# EAGLE design Side 1 esp32 old (EAGLE 8.5.1)
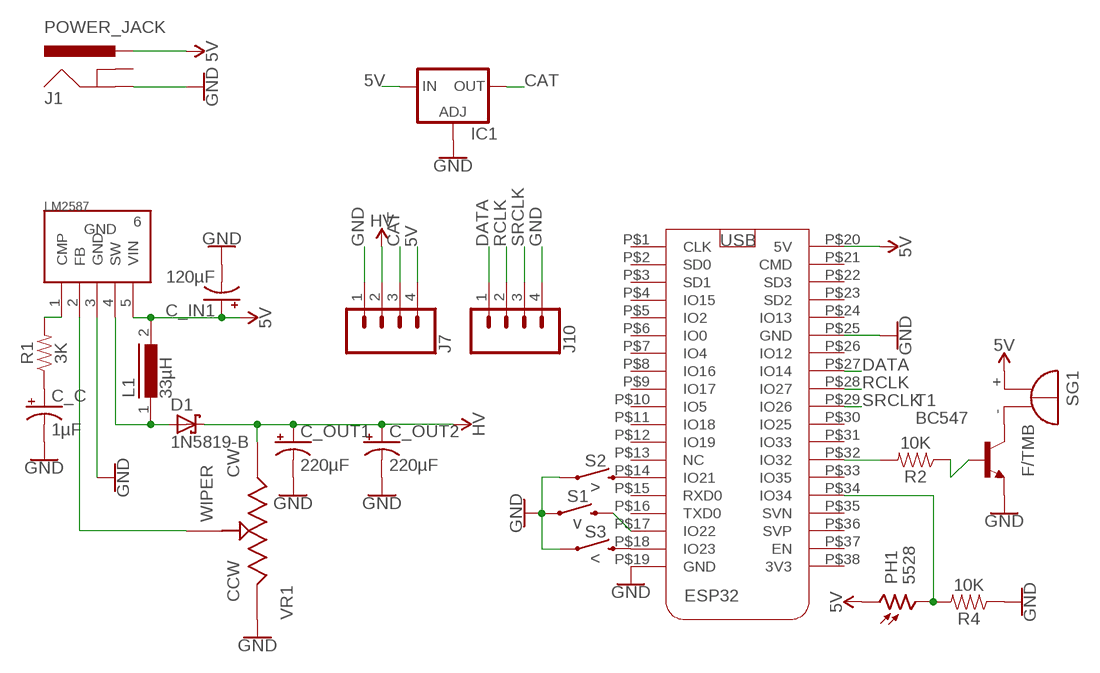
[diagram p0: schematic, sheet 1]

## Parts
C_C  1µF  CAP_POL_1µF  [CAP_POL_2MM]
C_IN1  120µF  CAP_POL_120µF  [CAP_POL_3MM]
C_OUT1  220µF  1000UF-RADIAL-5MM-25V-20%  [CPOL-RADIAL-5MM-10MM]
C_OUT2  220µF  1000UF-RADIAL-5MM-25V-20%  [CPOL-RADIAL-5MM-10MM]
D1  1N5819-B  [DO41-7.6]
ESP32  ESP32_DEVKIT  [ESP32_DEVKIT]
IC1  LM317TS  [317TS]
J1  POWER_JACK  [POWER_JACK_PTH]
J7  CONN_04  [1X04]
J10  CONN_04  [1X04]
L1  33µH  MICC12  [MICC12]
LM2587  LM2587S  [TO263-5]
PH1  5528  [5528]
R1  3K  RESISTORAXIAL-0.3  [AXIAL-0.3]
R2  10K  RESISTORAXIAL-0.3  [AXIAL-0.3]
R4  10K  RESISTORAXIAL-0.3  [AXIAL-0.3]
S1  v  MOMENTARY-SWITCH-SPST-PTH-6.0MM  [TACTILE_SWITCH_PTH_6.0MM]
S2  >  MOMENTARY-SWITCH-SPST-PTH-6.0MM  [TACTILE_SWITCH_PTH_6.0MM]
S3  <  MOMENTARY-SWITCH-SPST-PTH-6.0MM  [TACTILE_SWITCH_PTH_6.0MM]
SG1  F/TMB  [F/TMB]
T1  BC547  [TO92]
VR1  3296W-1-103LF  [W]

## Nets
5V: C_IN1.POS(+) ESP32.P$20(5V) IC1.3(IN) J1.PWR J7.4 L1.2 LM2587.5(VIN) PH1.1 SG1.+
CAT: IC1.2(OUT) J7.3
DATA: ESP32.P$27(IO14) J10.1
GND: C_C.NEG(-) C_IN1.NEG(-) C_OUT1.- C_OUT2.- ESP32.P$19(GND) ESP32.P$25(GND) IC1.1(ADJ) J1.GND J7.1 J10.4 LM2587.3(GND) R4.P$1 S1.1 S2.1 S3.1 T1.1(E) VR1.1
N$1: D1.A L1.1 LM2587.4(SW)
N$2: LM2587.1(CMP) R1.P$2
N$3: LM2587.2(FB) VR1.2
N$4: C_C.POS(+) R1.P$1
N$5: ESP32.P$34(IO34) PH1.2 R4.P$2
N$6: ESP32.P$17(IO22) S1.3
N$7: ESP32.P$18(IO23) S3.3
N$8: ESP32.P$14(IO21) S2.3
N$9: SG1.- T1.3(C)
N$10: R2.P$1 T1.2(B)
N$11: ESP32.P$32(IO32) R2.P$2
RCLK: ESP32.P$28(IO27) J10.2
SRCLK: ESP32.P$29(IO26) J10.3
VCC: C_OUT1.+ C_OUT2.+ D1.C J7.2 VR1.3 ; supply symbol labelled HV
Unconnected: ESP32.P$1(CLK) ESP32.P$2(SD0) ESP32.P$3(SD1) ESP32.P$4(IO15) ESP32.P$5(IO2) ESP32.P$6(IO0) ESP32.P$7(IO4) ESP32.P$8(IO16) ESP32.P$9(IO17) ESP32.P$10(IO5) ESP32.P$11(IO18) ESP32.P$12(IO19) ESP32.P$13(NC) ESP32.P$15(RXD0) ESP32.P$16(TXD0) ESP32.P$21(CMD) ESP32.P$22(SD3) ESP32.P$23(SD2) ESP32.P$24(IO13) ESP32.P$26(IO12) ESP32.P$30(IO25) ESP32.P$31(IO33) ESP32.P$33(IO35) ESP32.P$35(SVN) ESP32.P$36(SVP) ESP32.P$37(EN) ESP32.P$38(3V3) J1.GNDBREAK LM2587.6(GND)

## Library data of the parts
C_C = Clock components:CAP_POL_1µF
C_IN1 = Clock components:CAP_POL_120µF
C_OUT1 C_OUT2 = SparkFun-Capacitors:1000UF: 1,000µF/1mF ceramic capacitors A capacitor is a passive two-terminal electrical component used to store electrical energy temporarily in an electric field. CAP-08070; PROD_ID: CAP-09538; VALUE: 1mF
D1 = diode:1N581*: 1.0A SCHOTTKY BARRIER RECTIFIER Source: http://www.diodes.com/datasheets/ds23001.pdf
ESP32 = Clock components:ESP32_DEVKIT
IC1 = v-reg:LM317TS: VOLTAGE REGULATOR
J1 = SparkFun-Connectors:POWER_JACK: Power Jack Connector This is the standard 5.5mm barrel jack for power. The PTH is the most common, proven, reliable, footprint. The Slot footprint only works if the mill layer is transmitted to the PCB fab house so be warned. Here are the connectors we sell at SparkFun: DC Barrel Power Jack/Connector <https://www.sparkfun.com/products/119> (PRT-00119) DC Barrel Power Jack/Connector (SMD) <https://www.sparkfun.com/products/12748> (PRT-12748) DC Barrel Jack Adapter - Breadboard Compatible <https://www.sparkfun.com/products/10811> (PRT-10811) It is used on this SparkFun product (and many, many others): SparkFun RedBoard - Programmed with Arduino <https://www.sparkfun.com/products/12757> (DEV-12757) Also, if you need a mating power supply or connector, please check these out: Wall Adapter Power Supply - 9VDC 650mA <https://www.sparkfun.com/products/298> (TOL-00298) DC Barrel Jack Adapter - Male <https://www.sparkfun.com/products/10287> (PRT-10287); PROD_ID: CONN-08197
J7 J10 = SparkFun-Connectors:CONN_04: Multi connection point. Often used as Generic Header-pin footprint for 0.1 inch spaced/style header connections On any of the 0.1 inch spaced packages, you can populate with these: Break Away Headers - Straight <https://www.sparkfun.com/products/116> (PRT-00116) Break Away Male Headers - Right Angle <https://www.sparkfun.com/products/553> (PRT-00553) Female Headers <https://www.sparkfun.com/products/115> (PRT-00115) Break Away Headers - Machine Pin <https://www.sparkfun.com/products/117> (PRT-00117) Break Away Female Headers - Swiss Machine Pin <https://www.sparkfun.com/products/743> (PRT-00743) For SCREWTERMINALS and SPRING TERMINALS visit here: Screw Terimnals on SparkFun.com <https://www.sparkfun.com/search/results?term=Screw+Terminals> (5mm/3.5mm/2.54mm spacing) This device is also useful as a general connection point to wire up your design to another part of your project. Our various solder wires solder well into these plated through hole pads. Hook-Up Wire - Assortment (Stranded, 22 AWG) <https://www.sparkfun.com/products/11375> (PRT-11375) Hook-Up Wire - Assortment (Solid Core, 22 AWG) <https://www.sparkfun.com/products/11367> (PRT-11367) View the entire wire category on our website here <https://www.sparkfun.com/categories/141> Special notes: Molex polarized connector foot print use with SKU : PRT-08231 with associated crimp pins and housings. 1MM SMD Version SKU: PRT-10208; PROD_ID: CONN-09696
L1 = inductors:MICC12: INDUCTOR; SPICEPREFIX: L
LM2587 = Clock components:LM2587S: LM2587 SIMPLE SWITCHER 5A Flyback Regulator
PH1 = Clock components:5528
R1 R2 R4 = SparkFun-Resistors:RESISTOR: Generic Resistor Package
S1-S3 = SparkFun-Switches:MOMENTARY-SWITCH-SPST: Momentary Switch (Pushbutton) - SPST Normally-open (NO) SPST momentary switches (buttons, pushbuttons). Variants PTH-12MM - 12mm square, through-hole Momentary Pushbutton Switch - 12mm Square <https://www.sparkfun.com/products/9190> (COM-09190) PTH-6.0MM, PTH-6.0MM-KIT - 6.0mm square, through-hole Mini Pushbutton Switch <https://www.sparkfun.com/products/97> (COM-00097) KIT package intended for soldering kit's - only one side of pads' copper is exposed. PTH-RIGHT-ANGLE-KIT - Right-angle, through-hole Right Angle Tactile Button <https://www.sparkfun.com/products/10791> - Used on SparkFun BigTime Watch Kit <https://www.sparkfun.com/products/11734> SMD-12MM - 12mm square, surface-mount Tactile Button - SMD (12mm) <https://www.sparkfun.com/products/12993> (COM-12993) Used on SparkFun PicoBoard <https://www.sparkfun.com/products/11888> SMD-4.5MM - 4.5mm Square Trackball Switch Used on SparkFun Blackberry Trackballer Breakout <https://www.sparkfun.com/products/13169> SMD-4.6MMX2.8MM - 4.60mm x 2.80mm, surface mount Used on SparkFun SAMD21 Mini Breakout <https://www.sparkfun.com/products/13664> SMD-5.2MM, SMD-5.2-REDUNDANT - 5.2mm square, surface-mount Mini Pushbutton Switch - SMD <https://www.sparkfun.com/products/8720> (COM-08720) Used on Arduino Pro Mini <https://www.sparkfun.com/products/11114> REDUNDANT package connects both switch circuits together SMD-6.0X3.5MM - 6.0 x 3.5mm, surface mount Momentary Reset Switch SMD <https://www.sparkfun.com/products/8229> (COM-08229) SMD-6.2MM-TALL - 6.2mm square, surface mount Tactile Button - SMD (6mm) <https://www.sparkfun.com/products/12992> Used on SparkFun Digital Sandbox <https://www.sparkfun.com/products/12651> SMD-RIGHT-ANGLE - Right-angle, surface mount Used on SparkFun Block for Intel® Edison - Arduino <https://www.sparkfun.com/products/13036>; PROD_ID: SWCH-08441; SF_SKU: COM-00097
SG1 = buzzer:F/TMB: BUZZER Source: Buerklin; OC_FARNELL: unknown; OC_NEWARK: unknown
T1 = transistor:BC547: NPN TRANSISTOR
VR1 = Volks73-Bourns:3296?-*: Trim Potentiometer (Pot) Documentation Datasheet <http://www.bourns.com/data/global/pdfs/3296.pdf> Features Multiturn/Cermet/Industrial/Sealed 5 terminal styles Tape and reel packaging Chevron seal design Listed on the QPL for style RJ24 per MIL-R_22097 and RJR24 per High-Rel Mil-R-39035 Mounting hardware available (H-117P) RoHS compliant* version available For trimmer applications/processing guidelines, click here <http://www.bourns.com/data/global/pdfs/ap_proc.pdf>; ADJUSTMENT_TYPE: Tope Adjustment; CATEGORY: Potentiometers, Variable Resistors; DESCRIPTION: TRIMMER 10K OHM 0.5W PC PIN; DOCUMENTATION_LINK: <a href="http://www.bourns.com/data/global/pdfs/3296.pdf">Datasheet</a>; DOCUMENTATION_URL: http://www.bourns.com/data/global/pdfs/3296.pdf; FAMILY: Trimmer Potentiometers; MANUFACTURER: Bourns Inc; MOUNTING_TYPE: Through Hole; NUMBER_OF_TURNS: 25; PART_NUMBER: 3296W-1-103LF; POWER: 0.5W, 1/2W; RESISTANCE: 10k; RESISTIVE_MATERIAL: Cermet; SERIES: Trimpt 3296 - Sealed; SIZE: Rectangular - 0.375" x 0.190" Face x 0.395" H (9.53mm x 4.83mm x 10.03mm); STANDARD_PACKAGE: 50; SUPPLIER_ITEM_LINK: <a href="http://www.digikey.com/product-detail/en/3296W-1-103LF/3296W-103LF-ND/1088045">Details</a>; SUPPLIER_ITEM_NUMBER: 3296W-103LF-ND; SUPPLIER_ITEM_URL: http://www.digikey.com/product-detail/en/3296W-1-103LF/3296W-103LF-ND/1088045; SUPPLIER_LINK: <a href="http://www.digikey.com">Home Page</a>; SUPPLIER_NAME: Digi-Key; SUPPLIER_URL: http://www.digikey.com; TEMPERATURE_COEFFICIENT: 100ppm/C; TERMINATION_STYLE: PC Pin; TOLERANCE: 10%

## Board
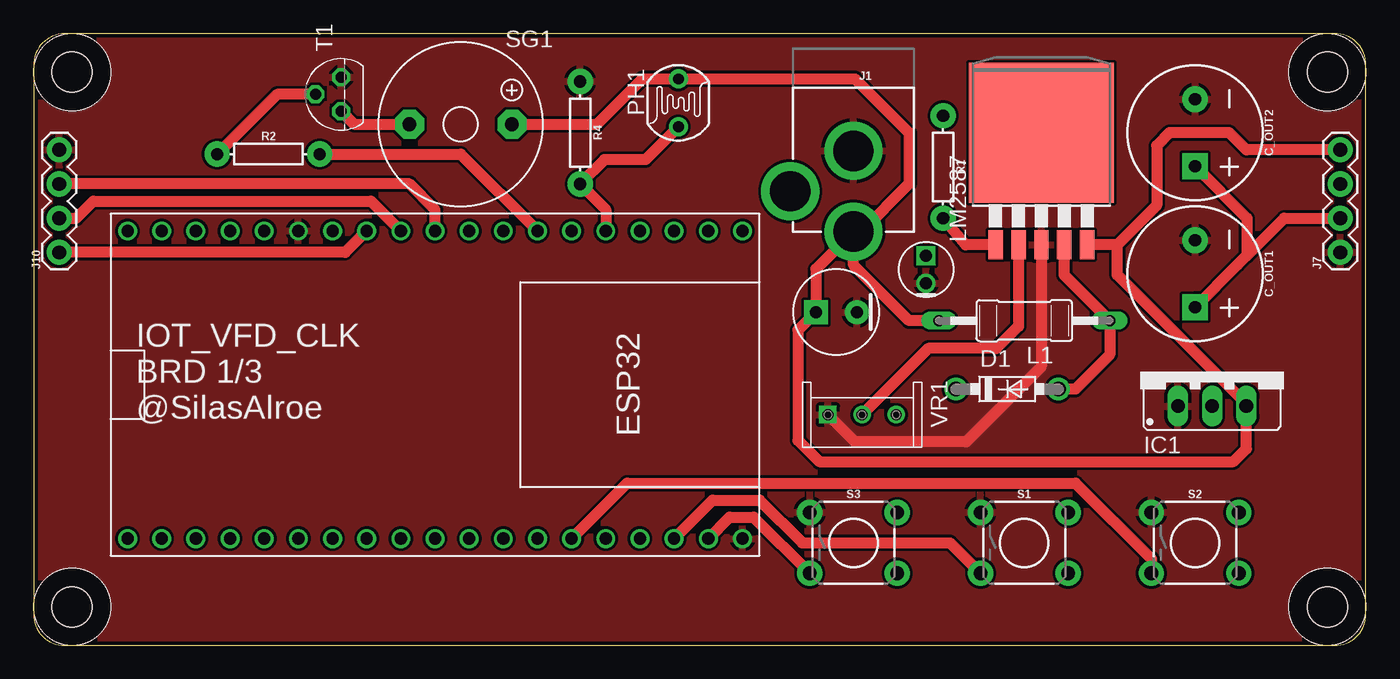
[diagram p1: board, top side]
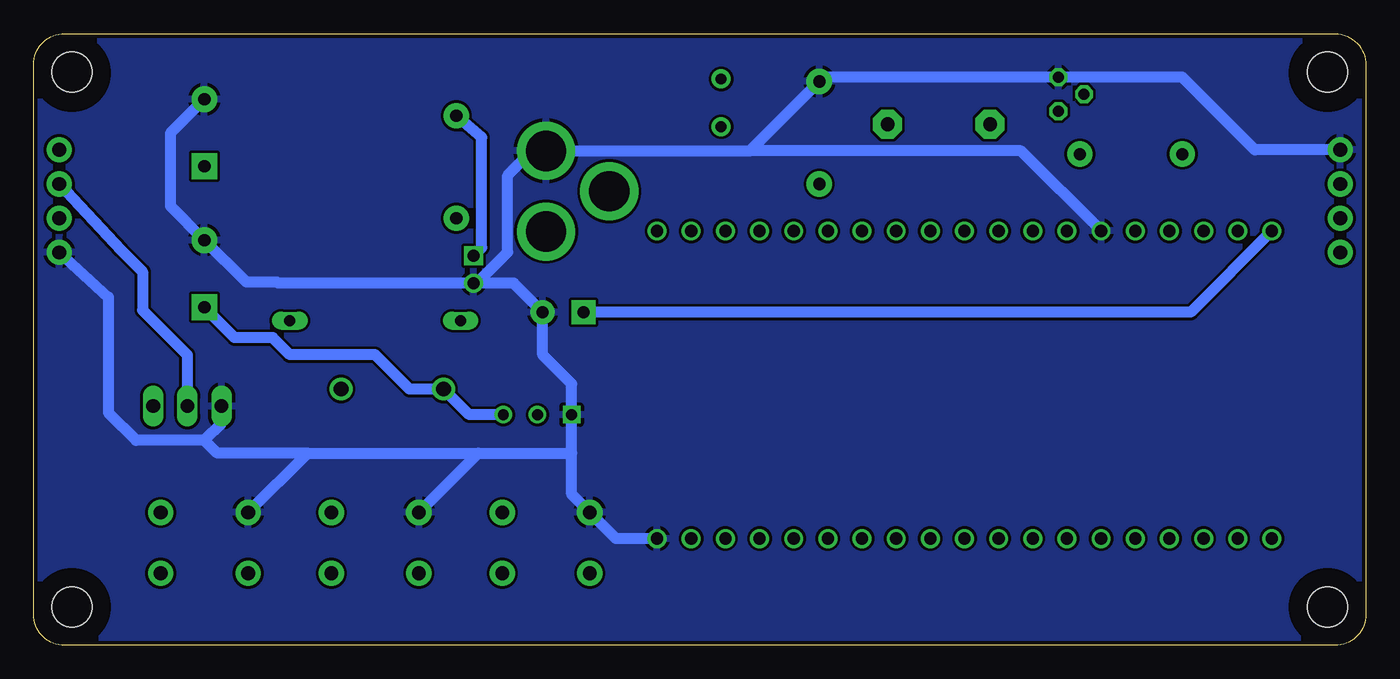
[diagram p2: board, bottom side, seen from below]

Size 99.06 x 45.47 mm. Coordinates in mm from the lower left corner, seen from the top.
Outline: 96.77,45.47 2.28,45.47 arc90 0,43.11 0,2.29 arc90 2.29,0 96.77,0 arc90 99.06,2.29 99.06,43.18 arc90 96.77,45.47
Copper layers (1*16): Top 0.035mm / dielectric 1.5mm / Bottom 0.035mm
Design rules "default *": minimum track width 12mil, minimum drill 0.35mm, track to track 8mil, track to pad 8mil, pad to pad 8mil, via to via 8mil, smd to smd 8mil, copper to edge 12mil, drill to drill 12mil, minimum pad ring 10mil, minimum via ring 8mil, stop-mask expansion 4mil, vias tented up to drill 0mil, thermal gap 10mil
Holes 3 mm at 2.86,2.86 2.86,42.61 96.2,42.61 96.2,2.86
tRestrict: area 1.2,1.2 to 4.5,4.5; area 1.2,40.9 to 4.5,44.2; area 94.6,40.9 to 97.8,44.2; area 94.6,1.2 to 97.8,4.5
bRestrict: area 1.2,1.2 to 4.5,4.5; area 1.2,40.9 to 4.5,44.2; area 94.6,40.9 to 97.8,44.2; area 94.6,1.2 to 97.8,4.5

### Footprints (pad centres in the part's own frame; a part is rotated, then mirrored left to right if it is on the bottom)
CAP_POL_2MM = drill 0.9: NEG 1.016,0 | drill 0.9 square: POS -1.016,0
CAP_POL_3MM = drill 0.9 pad 1.778: NEG 1.524,0 | drill 0.9 pad 1.778 square: POS -1.524,0
CPOL-RADIAL-5MM-10MM = drill 0.9 pad 1.93 square: + 2.5,0 | drill 0.9 pad 1.93: - -2.5,0
DO41-7.6 = drill 1.1 pad 1.7: A 3.81,0; C -3.81,0
ESP32_DEVKIT = drill 0.9: P$1 -11.43,0; P$2 -11.43,-2.54; P$3 -11.43,-5.08; P$4 -11.43,-7.62; P$5 -11.43,-10.16; P$6 -11.43,-12.7; P$7 -11.43,-15.24; P$8 -11.43,-17.78; P$9 -11.43,-20.32; P$10 -11.43,-22.86; P$11 -11.43,-25.4; P$12 -11.43,-27.94; P$13 -11.43,-30.48; P$14 -11.43,-33.02; P$15 -11.43,-35.56; P$16 -11.43,-38.1; P$17 -11.43,-40.64; P$18 -11.43,-43.18; P$19 -11.43,-45.72; P$20 11.43,0; P$21 11.43,-2.54; P$22 11.43,-5.08; P$23 11.43,-7.62; P$24 11.43,-10.16; P$25 11.43,-12.7; P$26 11.43,-15.24; P$27 11.43,-17.78; P$28 11.43,-20.32; P$29 11.43,-22.86; P$30 11.43,-25.4; P$31 11.43,-27.94; P$32 11.43,-30.48; P$33 11.43,-33.02; P$34 11.43,-35.56; P$35 11.43,-38.1; P$36 11.43,-40.64; P$37 11.43,-43.18; P$38 11.43,-45.72
317TS = drill 1.016 long: 1 -2.54,-2.54; 2 0,-2.54; 3 2.54,-2.54
POWER_JACK_PTH = drill 2.997 pad 4.318: GND 0,7.7; GNDBREAK 4.7,10.7; PWR 0,13.7
1X04 = drill 1.016 pad 1.88: 1 0,0; 2 2.54,0; 3 5.08,0; 4 7.62,0
MICC12 = drill 0.813 long: 1 -6.35,0; 2 6.35,0
TO263-5 = smd 1.067 x 2.159: 1 -3.404,-5.791; 2 -1.702,-5.791; 3 0,-5.791; 4 1.702,-5.791; 5 3.404,-5.791 | smd 10.8 x 10.41: 6 0,2.54
5528 = drill 0.8 pad 1.4: 1 -1.778,0; 2 1.778,0
AXIAL-0.3 = drill 0.9 pad 1.88: P$1 -3.81,0; P$2 3.81,0
TACTILE_SWITCH_PTH_6.0MM = drill 1.016 pad 1.88: 1 -3.251,2.261; 2 3.251,2.261; 3 -3.251,-2.261; 4 3.251,-2.261
F/TMB = drill 1.016 pad 2.159 octagon: + 3.81,0; - -3.81,0
TO92 = drill 0.813 octagon: 1 1.27,0; 2 0,1.905; 3 -1.27,0
W = drill 0.8 square: 1 0,-2.54 | drill 0.8: 2 0,0; 3 0,2.54

### Placement (x,y rotation side)
C_C  66.36,27.94 270 top
C_IN1  59.69,24.77 0 top
C_OUT1  86.36,27.62 270 top
C_OUT2  86.36,38.1 270 top
D1  72.39,19.05 0 top
ESP32  6.99,19.37 90 top
IC1  87.63,20.32 0 top
J1  60.96,44.45 180 top
J7  97.16,29.21 90 top
J10  1.91,29.21 90 top
L1  73.66,24.13 180 top
LM2587  74.93,35.56 0 top
PH1  47.94,40.32 270 top
R1  67.63,35.56 270 top
R2  17.46,36.51 0 top
R4  40.64,38.1 270 top
S1  73.66,7.62 0 top
S2  86.36,7.62 0 top
S3  60.96,7.62 0 top
SG1  31.75,38.73 0 top
T1  22.86,40.96 90 top
VR1  61.59,17.14 270 top

### Tracks (layer width: path | path; a pad name or v marks a point on that pad's centre or on a via)
5V
  Top 0.813: J7.4 90.17,36.83 88.9,38.1 84.45,38.1 83.5,37.15 83.5,32.7 80.57,29.77 | 80.57,29.77 LM2587.5 | J1.PWR 61.55,30.75 65.09,34.29 65.09,38.1 61.09,42.1 PH1.1 45.28,42.1 41.91,38.73 SG1.+ | J1.PWR 58.17,27.96 C_IN1.POS 56.83,23.43 56.83,15.24 58.42,13.65 89.22,13.65 90.17,14.61 IC1.3 90.17,17.94 80.57,27.54 80.57,29.77 | L1.2 65.09,24.13 60.96,28.26 J1.PWR
  Bottom 0.813: ESP32.P$20 13.02,24.77 C_IN1.POS
CAT
  Bottom 0.813: IC1.2 87.63,21.59 90.96,24.92 90.96,27.78 92.55,29.37 J7.3
DATA
  Top 0.813: J10.1 23.18,29.21 ESP32.P$27
GND
  Top 0.813: LM2587.3 74.93,20.7 69.34,15.11 61.09,15.11 VR1.1
  Bottom 0.813: IC1.1 85.09,16.51 86.36,15.24 | 86.36,15.24 91.44,15.24 93.5,17.3 93.5,25.88 J7.1 | C_OUT2.- 88.9,38.06 88.9,32.66 C_OUT1.- | 86.36,30.48 C_OUT1.- | J10.4 8.26,36.83 13.65,42.23 T1.1 40.32,42.23 R4.P$1 45.8,36.75 | 45.8,36.75 J1.GND 61.99,36.75 63.82,34.92 63.82,29.23 66.12,26.92 C_C.NEG | ESP32.P$25 25.64,36.75 45.8,36.75 | C_C.NEG 63.37,26.92 C_IN1.NEG 61.21,21.59 59.05,19.43 VR1.1 59.05,14.29 | 59.05,14.29 59.05,11.23 S3.1 55.77,7.94 ESP32.P$19 | S1.1 66,14.29 | 66,14.29 59.05,14.29 | S2.1 78.7,14.29 | 78.7,14.29 66,14.29 | 78.7,14.29 85.41,14.29 86.36,15.24 | C_C.NEG 80.9,26.92 80.96,26.99 83.22,26.99 C_OUT1.-
  pour Bottom: 0,0 0,45.4 98.11,45.4 99.06,44.45 99.06,0
  pour Top: 0,0 0,44.45 0.95,45.4 99.06,45.4 99.06,0
N$1
  Top 0.813: LM2587.4 76.63,27.51 L1.1 80.01,21.59 77.47,19.05 D1.A
N$2
  Top 0.813: LM2587.1 69.29,29.77 R1.P$2
N$3
  Top 0.813: LM2587.2 73.23,23.7 71.6,22.07 66.52,22.07 VR1.2
N$4
  Bottom 0.813: R1.P$1 65.75,37.76 65.75,29.57 C_C.POS
N$5
  Top 0.813: ESP32.P$34 42.55,32.38 R4.P$2 42.45,36.1 45.5,36.1 PH1.2
N$6
  Top 0.813: S1.3 68.15,7.62 57.15,7.62 53.98,10.79 50.48,10.79 ESP32.P$17
N$7
  Top 0.813: S3.3 53.54,9.53 51.75,9.53 ESP32.P$18
N$8
  Top 0.813: S2.3 83.11,6.43 77.47,12.06 44.13,12.06 ESP32.P$14
N$9
  Top 0.813: T1.3 23.81,38.73 SG1.-
N$10
  Top 0.813: T1.2 18.1,40.96 R2.P$1
N$11
  Top 0.813: R2.P$2 31.75,36.51 ESP32.P$32
RCLK
  Top 0.813: ESP32.P$28 25.08,33.02 4.45,33.02 3.17,31.75 J10.2
SRCLK
  Top 0.813: ESP32.P$29 29.84,32.38 27.94,34.29 J10.3
VCC
  Top 0.813: 86.36,25.72 C_OUT1.+ 89.52,28.28 90.15,28.91 90.21,28.97 | 90.21,28.97 92.99,31.75 J7.2 | C_OUT2.+ 90.21,31.75 90.21,28.97
  Bottom 0.813: VR1.3 66.67,17.14 D1.C 71.12,19.05 73.68,21.61 80.01,21.61 81.28,22.88 84.12,22.88 C_OUT1.+

### Text on the board
tNames: IOT_VFD_CLK / BRD 1/3 / @SilasAlroe